# EAGLE design Siscom Seguidor_1 (EAGLE 7.6.0)
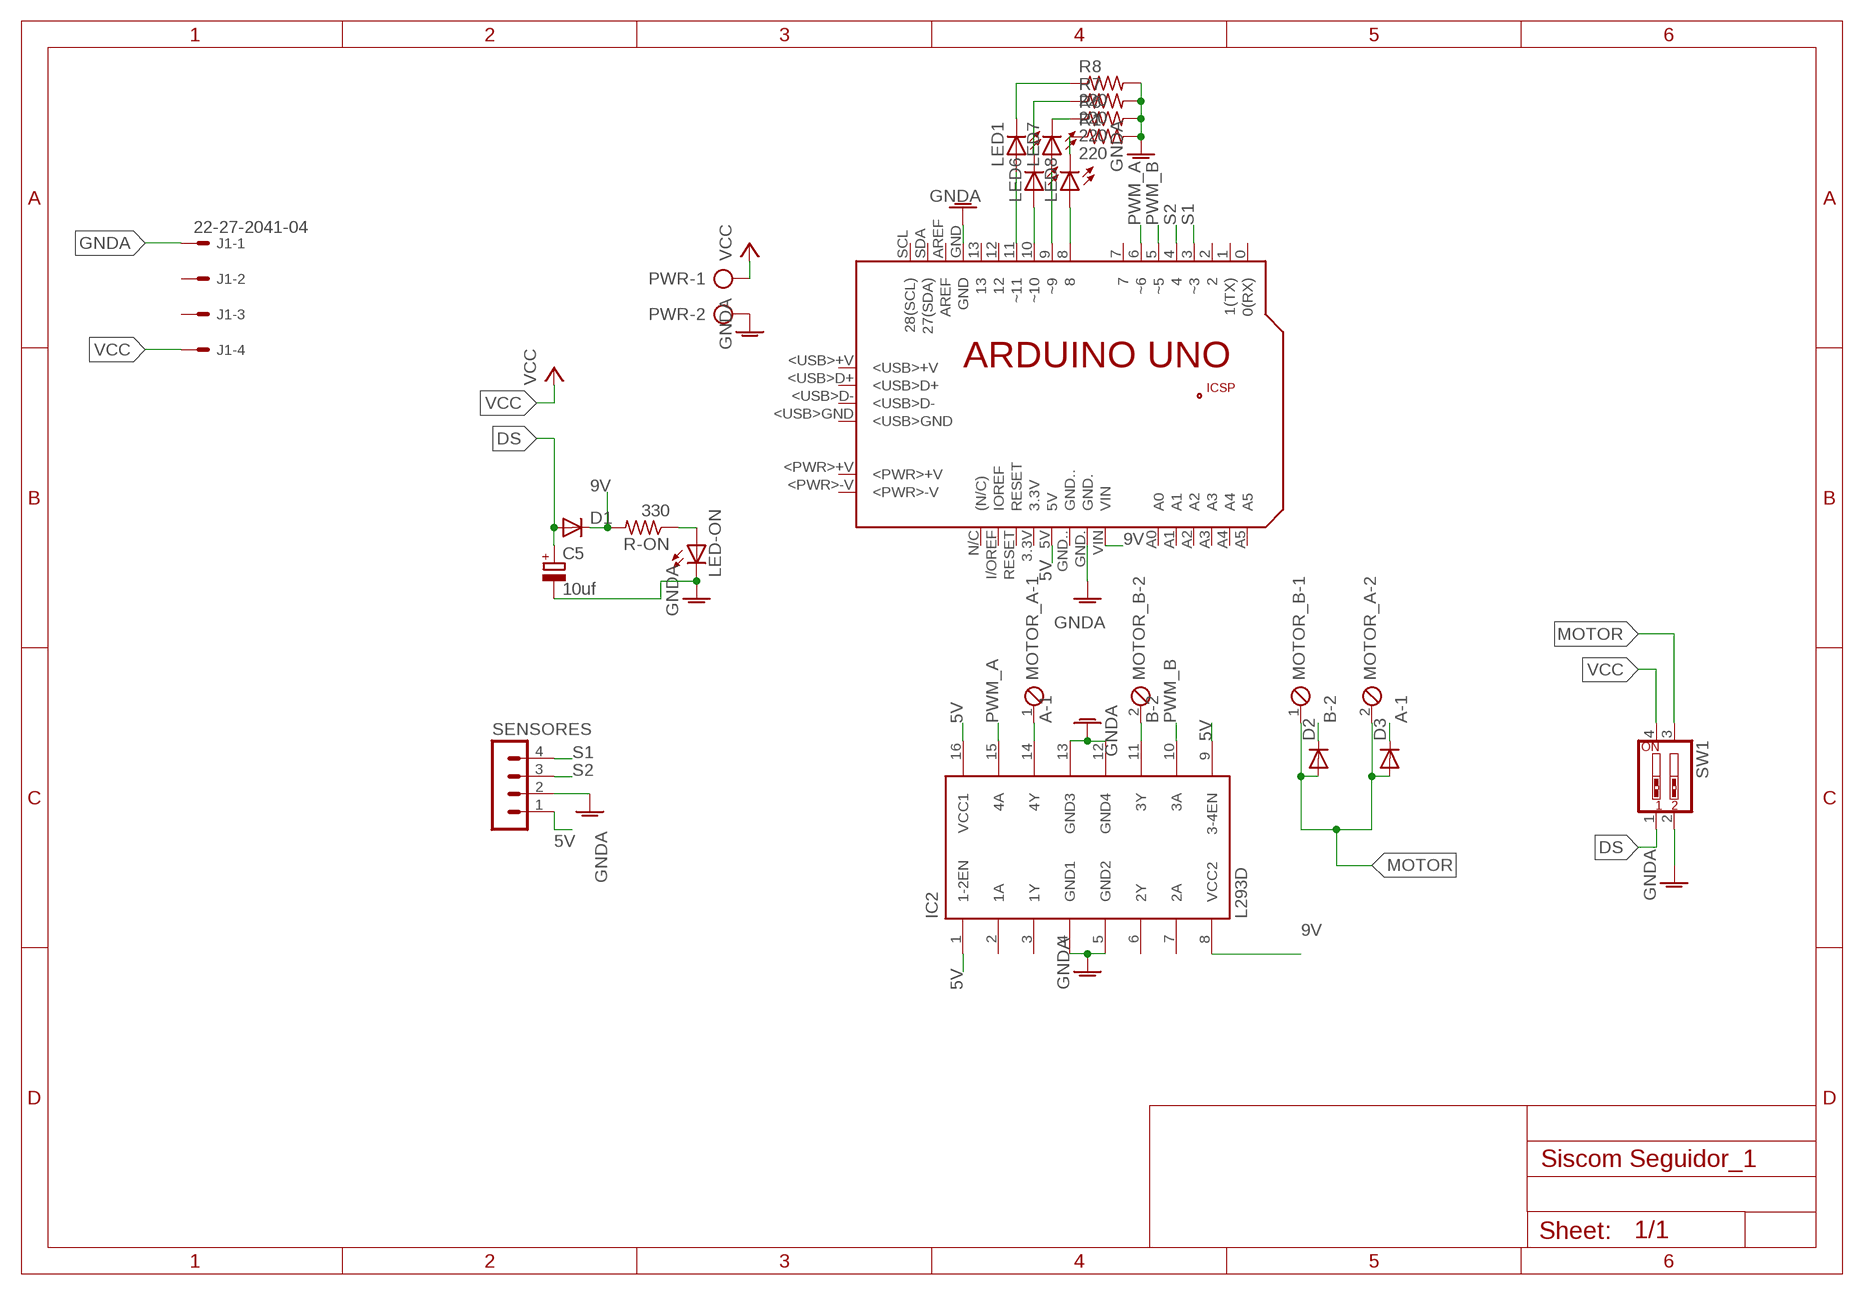
[diagram p0: schematic, sheet 1]

## Parts
C5  10uf  CPOL-EUE2,5-6E  [E2,5-6E]
D1  1N4148DO35-7  [DO35-7]
D2  1N4148DO35-7  [DO35-7]
D3  1N4148DO35-7  [DO35-7]
IC2  L293D  [DIL16]
J1  22-27-2041-04  [6410-04]
LED1  LED3MM  [LED3MM]
LED6  LED3MM  [LED3MM]
LED7  LED3MM  [LED3MM]
LED8  LED3MM  [LED3MM]
LED-ON  LED3MM  [LED3MM]
MOTOR_A  MPT2  [2POL254]
MOTOR_B  MPT2  [2POL254]
PCB2  ARDUINO_UNO  [ARDUINO_UNO]
PWR  AK500/2  [AK500/2]
R1  220  R-US_0204/7  [0204/7]
R6  220  R-US_0204/7  [0204/7]
R7  220  R-US_0204/7  [0204/7]
R8  220  R-US_0204/7  [0204/7]
R-ON  330  R-US_0204/7  [0204/7]
SENSORES  MA04-1  [MA04-1]
SW1  SW_DIP-2  [EDG-02]

## Nets
5V: IC2.1(1-2EN) IC2.9(3-4EN) IC2.16(VCC1) PCB2.5V SENSORES.1
9V: D1.C IC2.8(VCC2) PCB2.VIN R-ON.2
A-1: D3.C IC2.14(4Y) MOTOR_A.1
B-2: D2.C IC2.11(3Y) MOTOR_B.2
DS: C5.+ D1.A SW1.1
GNDA: C5.- IC2.4(GND1) IC2.5(GND2) IC2.12(GND4) IC2.13(GND3) J1.1 LED-ON.K(C) PCB2.GND PCB2.GND. PWR.2 R1.2 R6.2 R7.2 R8.2 SENSORES.2 SW1.2
MOTOR: D2.A D3.A MOTOR_A.2 MOTOR_B.1 SW1.3
N$9: LED-ON.A R-ON.1
N$22: LED8.K(C) R1.1
N$23: LED7.K(C) R6.1
N$24: LED6.K(C) R7.1
N$25: LED1.K(C) R8.1
N$26: LED7.A PCB2.9(~9)
N$27: LED1.A PCB2.11(~11)
N$28: LED6.A PCB2.10(~10)
N$29: LED8.A PCB2.8
PWM_A: IC2.15(4A) PCB2.6(~6)
PWM_B: IC2.10(3A) PCB2.5(~5)
S1: PCB2.3(~3) SENSORES.4
S2: PCB2.4 SENSORES.3
VCC: J1.4 PWR.1 SW1.4
Unconnected: IC2.2(1A) IC2.3(1Y) IC2.6(2Y) IC2.7(2A) J1.2 J1.3 PCB2.0(0(RX)) PCB2.1(1(TX)) PCB2.2 PCB2.3.3V PCB2.7 PCB2.12 PCB2.13 PCB2.+5V PCB2.<PWR>+V PCB2.<PWR>-V PCB2.<USB>+V PCB2.<USB>D+ PCB2.<USB>D- PCB2.<USB>GND PCB2.A0 PCB2.A1 PCB2.A2 PCB2.A3 PCB2.A4 PCB2.A5 PCB2.AREF PCB2.GND.. PCB2.GND_ PCB2.I/OREF(IOREF) PCB2.MISO PCB2.MOSI PCB2.N/C((N/C)) PCB2.RESET PCB2.RESET. PCB2.SCK PCB2.SCL(28(SCL)) PCB2.SDA(27(SDA))

## Library data of the parts
C5 = rcl:CPOL-EU: POLARIZED CAPACITOR, European symbol
D1-D3 = _mod_diode:1N4148: DIODE high speed (Philips)
IC2 = st-microelectronics:L293D: PUSH-PULL 4 CHANNEL DRIVER; MPN: L293D; OC_FARNELL: 9589619; OC_NEWARK: 56P8249
J1 = con-molex:22-?-04: CONNECTOR wire to board 2.54 mm (.1 inch) pitch header; OC_FARNELL: unknown; OC_NEWARK: unknown
LED1 LED6-LED8 LED-ON = led:LED: LED OSRAM: - CHIPLED LG R971, LG N971, LY N971, LG Q971, LY Q971, LO R971, LY R971 LH N974, LH R974 LS Q976, LO Q976, LY Q976 LO Q996 - Hyper CHIPLED LW Q18S LB Q993, LB Q99A, LB R99A - SideLED LS A670, LO A670, LY A670, LG A670, LP A670 LB A673, LV A673, LT A673, LW A673 LH A674 LY A675 LS A676, LA A676, LO A676, LY A676, LW A676 LS A679, LY A679, LG A679 - Hyper Micro SIDELED® LS Y876, LA Y876, LO Y876, LY Y876 LT Y87S - SmartLED LW L88C, LW L88S LB L89C, LB L89S, LG L890 LS L89K, LO L89K, LY L89K LS L896, LA L896, LO L896, LY L896 - TOPLED LS T670, LO T670, LY T670, LG T670, LP T670 LSG T670, LSP T670, LSY T670, LOP T670, LYG T670 LG T671, LOG T671, LSG T671 LB T673, LV T673, LT T673, LW T673 LH T674 LS T676, LA T676, LO T676, LY T676, LB T676, LH T676, LSB T676, LW T676 LB T67C, LV T67C, LT T67C, LS T67K, LO T67K, LY T67K, LW E67C LS E67B, LA E67B, LO E67B, LY E67B, LB E67C, LV E67C, LT E67C LW T67C LS T679, LY T679, LG T679 LS T770, LO T770, LY T770, LG T770, LP T770 LB T773, LV T773, LT T773, LW T773 LH T774 LS E675, LA E675, LY E675, LS T675 LS T776, LA T776, LO T776, LY T776, LB T776 LHGB T686 LT T68C, LB T68C - Hyper Mini TOPLED® LB M676 - Mini TOPLED Santana® LG M470 LS M47K, LO M47K, LY M47K Source: http://www.osram.convergy.de LUXEON: - LUMILED® LXK2-PW12-R00, LXK2-PW12-S00, LXK2-PW14-U00, LXK2-PW14-V00 LXK2-PM12-R00, LXK2-PM12-S00, LXK2-PM14-U00 LXK2-PE12-Q00, LXK2-PE12-R00, LXK2-PE12-S00, LXK2-PE14-T00, LXK2-PE14-U00 LXK2-PB12-K00, LXK2-PB12-L00, LXK2-PB12-M00, LXK2-PB14-N00, LXK2-PB14-P00, LXK2-PB14-Q00 LXK2-PR12-L00, LXK2-PR12-M00, LXK2-PR14-Q00, LXK2-PR14-R00 LXK2-PD12-Q00, LXK2-PD12-R00, LXK2-PD12-S00 LXK2-PH12-R00, LXK2-PH12-S00 LXK2-PL12-P00, LXK2-PL12-Q00, LXK2-PL12-R00 Source: www.luxeon.com KINGBRIGHT: KA-3528ASYC Source: www.kingbright.com
MOTOR_A MOTOR_B = con-phoenix-254:MPT2: PHOENIX CONNECTOR; OC_FARNELL: unknown; OC_NEWARK: unknown
PCB2 = E14_Arduino_revC:ARDUINO_UNO: Device for representing an Arduino Uno board with a footprint in an EAGLE design. Created by Dave Young for Element14. More EAGLE documentation at: http://www.element14.com/community/community/knode/cadsoft_eagle
PWR = con-ptr500:AK500/2: CONNECTOR; OC_FARNELL: unknown; OC_NEWARK: unknown
R1 R6-R8 R-ON = rcl:R-US_: RESISTOR, American symbol
SENSORES = con-lstb:MA04-1: PIN HEADER; OC_FARNELL: unknown; OC_NEWARK: unknown
SW1 = special:SW_DIP-2: DIP SWITCH

## Board
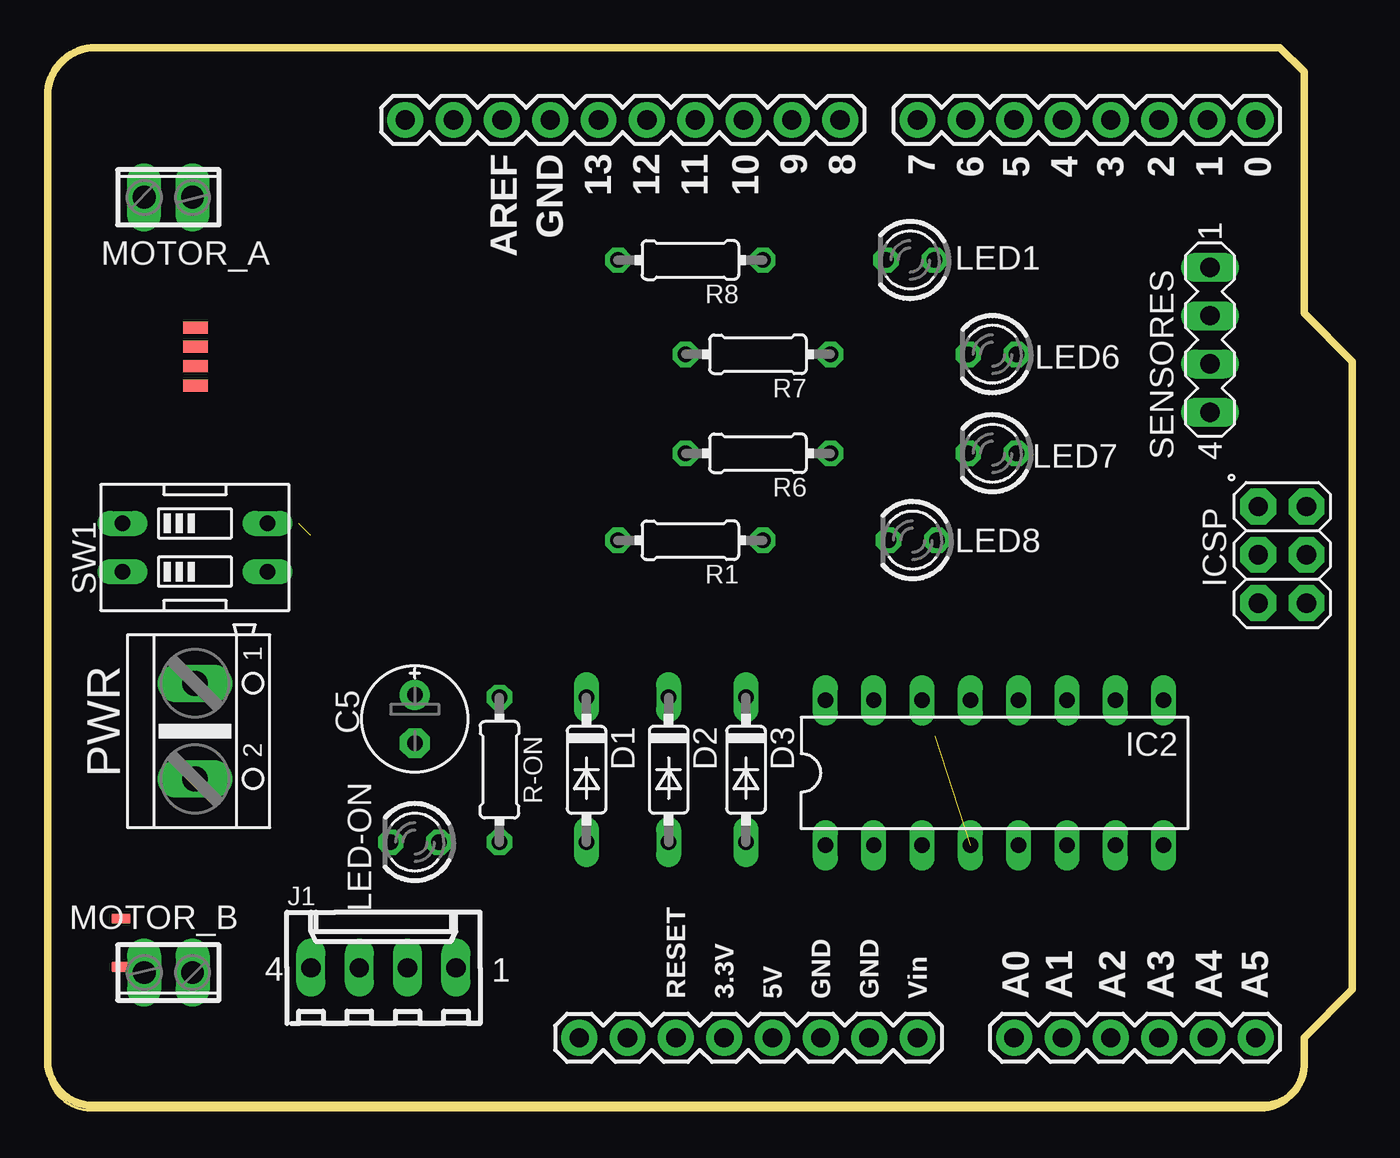
[diagram p1: board, top side]
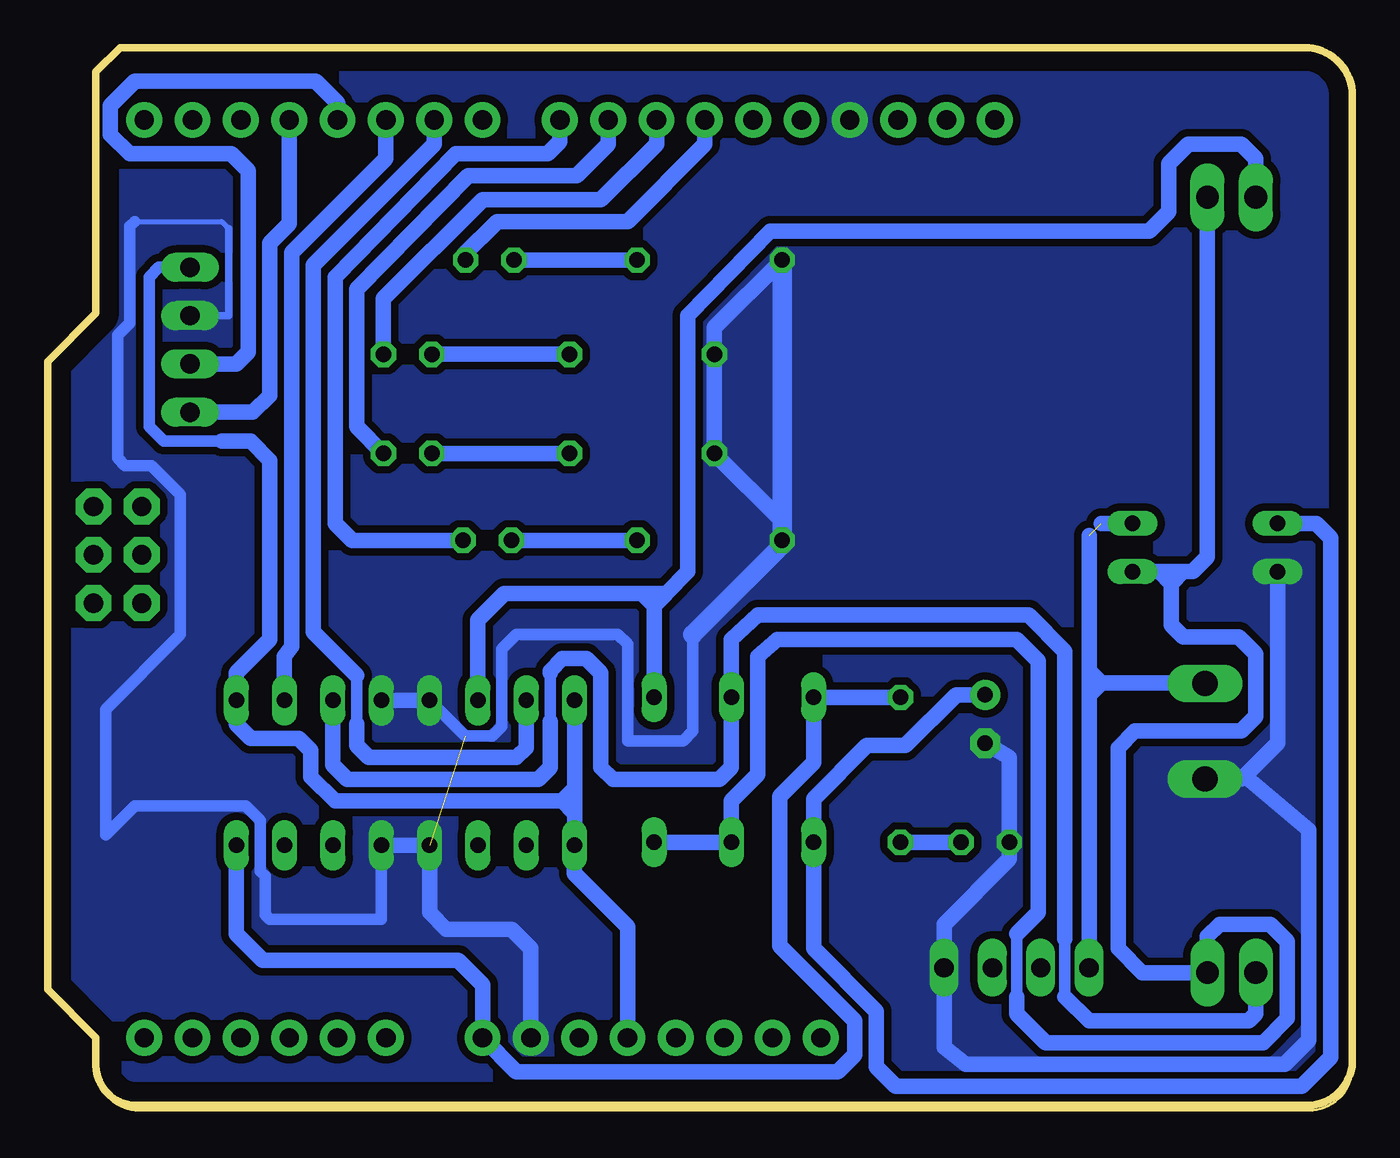
[diagram p2: board, bottom side, seen from below]

Size 68.58 x 55.63 mm. Coordinates in mm from the lower left corner, seen from the top.
Outline: 2.54,0 64.01,0 arc90 66.04,2.29 66.04,3.56 68.58,6.1 68.58,39.12 66.04,41.66 66.04,54.36 64.77,55.63 2.54,55.63 arc90 0,53.09 0,2.29 arc90 2.54,0
Copper layers (1*16): Top 0.035mm / dielectric 1.5mm / Bottom 0.035mm
Design rules "default": minimum track width 10mil, minimum drill 24mil, track to track 8mil, track to pad 8mil, pad to pad 8mil, via to via 8mil, smd to smd 8mil, copper to edge 40mil, drill to drill 8mil, minimum pad ring 10mil, minimum via ring 8mil, stop-mask expansion 4mil, vias tented up to drill 0mil, thermal gap 10mil

### Footprints (pad centres in the part's own frame; a part is rotated, then mirrored left to right if it is on the bottom)
E2,5-6E = drill 0.813 pad 1.575: + -1.27,0 | drill 0.813 pad 1.575 octagon: - 1.27,0
DO35-7 = drill 0.813 long: A 3.81,0; C -3.81,0
DIL16 = drill 0.813 long: 1 -8.89,-3.81; 2 -6.35,-3.81; 3 -3.81,-3.81; 4 -1.27,-3.81; 5 1.27,-3.81; 6 3.81,-3.81; 7 6.35,-3.81; 8 8.89,-3.81; 9 8.89,3.81; 10 6.35,3.81; 11 3.81,3.81; 12 1.27,3.81; 13 -1.27,3.81; 14 -3.81,3.81; 15 -6.35,3.81; 16 -8.89,3.81
6410-04 = drill 1.016 long: 1 3.81,0; 2 1.27,0; 3 -1.27,0; 4 -3.81,0
LED3MM = drill 0.813 octagon: A -1.27,0; K 1.27,0
2POL254 = drill 1.2 long: 1 -1.27,0; 2 1.27,0
ARDUINO_UNO = drill 1.016 pad 1.88: 0 63.5,50.8; 1 60.96,50.8; 2 58.42,50.8; 3 55.88,50.8; 3.3V 35.56,2.54; 4 53.34,50.8; 5 50.8,50.8; 5V 38.1,2.54; 6 48.26,50.8; 7 45.72,50.8; 8 41.656,50.8; 9 39.116,50.8; 10 36.576,50.8; 11 34.036,50.8; 12 31.496,50.8; 13 28.956,50.8; A0 50.8,2.54; A1 53.34,2.54; A2 55.88,2.54; A3 58.42,2.54; A4 60.96,2.54; A5 63.5,2.54; AREF 23.876,50.8; GND 26.416,50.8; GND. 43.18,2.54; GND.. 40.64,2.54; I/OREF 30.48,2.54; N/C 27.94,2.54; RESET 33.02,2.54; SCL 18.796,50.8; SDA 21.336,50.8; VIN 45.72,2.54 | drill 1.016 pad 1.88 octagon: +5V 66.167,30.48; GND_ 66.167,25.4; MISO 63.627,30.48; MOSI 66.167,27.94; RESET. 63.627,25.4; SCK 63.627,27.94 | smd 1.016 x 0.508: <PWR>+V 3.861,8.814; <PWR>-V 3.861,6.274 | smd 1.27 x 0.635: <USB>+V 7.772,39.878; <USB>D+ 7.772,38.887; <USB>D- 7.772,37.871; <USB>GND 7.772,36.83
AK500/2 = drill 1.321 long: 1 -2.515,0; 2 2.515,0
0204/7 = drill 0.813 octagon: 1 -3.81,0; 2 3.81,0
MA04-1 = drill 1.016 long: 1 -3.81,0; 2 -1.27,0; 3 1.27,0; 4 3.81,0
EDG-02 = drill 0.813 long: 1 -1.27,-3.81; 2 1.27,-3.81; 3 1.27,3.81; 4 -1.27,3.81

### Placement (x,y rotation side)
C5  19.3,20.32 270 top
D1  28.32,17.65 270 top
D2  32.64,17.65 270 top
D3  36.7,17.65 270 top
IC2  49.77,17.49 0 top
J1  17.65,7.24 0 top
LED1  45.34,44.45 180 top
LED6  49.66,39.5 180 top
LED7  49.66,34.29 180 top
LED8  45.47,29.72 180 top
LED-ON  19.3,13.84 180 top
MOTOR_A  6.35,47.75 0 top
MOTOR_B  6.35,6.99 180 top
PCB2  0,1.02 0 top
PWR  7.75,19.69 270 top
R1  33.78,29.72 180 top
R6  37.34,34.29 180 top
R7  37.34,39.5 180 top
R8  33.78,44.45 180 top
R-ON  23.75,17.65 90 top
SENSORES  61.09,40.26 270 top
SW1  7.75,29.34 270 top

### Tracks (layer width: path | path; a pad name or v marks a point on that pad's centre or on a via)
5V
  Bottom 0.61: 59.44,34.93 62.48,34.93 63.25,35.69 63.25,43.56 62.74,44.07 SENSORES.1
  Bottom 0.813: IC2.16 40.88,16 | 40.88,16 IC2.1 40.89,13.67 40.89,12.19 38.1,9.4 PCB2.5V | 41.53,16 53.47,16 54.74,17.27 54.74,18.67 55.37,19.31 57.91,19.31 58.66,20.05 IC2.9 58.67,21.31 58.67,22.73 56.9,24.51 56.9,33.91 57.91,34.93 59.44,34.93 | 40.88,16 41.53,16 | 41.53,16 40.89,16.64 | 41.53,16 40.89,15.37
9V
  Bottom 0.813: IC2.8 58.67,13.67 58.67,9.02 57.28,7.62 46.99,7.62 45.72,6.35 PCB2.VIN 43.94,1.78 27.05,1.78 26.16,2.67 26.16,4.45 30.1,8.38 30.1,16.26 28.32,18.04 D1.C R-ON.2
A-1
  Bottom 0.813: IC2.14 45.96,25.54 44.58,26.93 37.34,26.93 | 37.34,26.93 36.83,26.93 | 36.83,26.93 36.07,26.93 | 36.07,26.93 34.92,28.07 34.92,41.53 30.61,45.98 10.67,45.98 9.65,46.99 9.65,49.53 8.64,50.55 5.84,50.55 5.08,49.79 MOTOR_A.1 | D3.C 36.7,26.29 | 36.7,26.29 36.7,26.8 36.83,26.93 | 37.34,26.93 36.7,26.29 | 36.7,26.29 36.07,26.93
B-2
  Bottom 0.61: 15.11,5.72 15.11,8.76 | 42.16,22.73 42.16,20.19
  Bottom 0.813: MOTOR_B.2 5.08,4.83 5.46,4.45 13.84,4.45 15.11,5.72 | 15.11,8.76 15.11,23.88 17.02,25.78 31.24,25.78 32.64,24.51 D2.C 32.64,17.78 33.27,17.15 38.86,17.15 39.5,17.78 39.5,22.73 40.26,23.5 41.53,23.5 42.16,22.86 42.16,22.73 | 42.16,20.19 42.16,17.78 42.8,17.15 52.83,17.15 53.59,17.91 53.59,21.29 IC2.11
DS
  Bottom 0.813: SW1.1 1.91,30.61 1.14,29.85 1.14,2.54 2.67,1.02 24,1.02 25.02,2.03 25.02,4.95 28.32,8.26 D1.A 28.32,16.13 25.53,18.92 23.5,18.92 20.83,21.59 C5.+
GNDA  (1 unrouted)
  Bottom 0.254: 64.01,46.48 59.44,46.48 59.05,46.1
  Bottom 0.406: SENSORES.2 59.05,41.53 59.05,46.1
  Bottom 0.61: IC2.5 51.04,9.79 51.05,9.78 56.9,9.78 57.15,10.03 57.15,12.07 57.4,12.32 57.4,14.99 58.17,15.75 64.01,15.75 65.53,14.23 65.53,20.83 61.59,24.77 61.59,32.13 63.12,33.66 64.52,33.66 64.9,34.04 64.9,40.51 64.26,41.15 64.26,46.23 64.01,46.48 | 34.67,24.77 34.67,19.69 35.18,19.18 38.1,19.18 38.1,24.26 38.61,24.77 43.94,24.77 44.7,24 44.7,19.94 45.21,19.43 46.63,19.43 IC2.13
  Bottom 0.813: IC2.12 IC2.13 | IC2.5 IC2.4 48.5,10.15 47.62,9.27 44.2,9.27 43.18,8.26 PCB2.GND. | R1.2 29.97,30.74 R6.2 R7.2 33.53,40.9 R8.2 | PWR.2 5.82,17.17 5.65,17.34 | 5.65,17.34 3.94,19.05 SW1.2 | J1.1 21.46,8 | C5.- 18.03,18.29 LED-ON.K 18.03,12.96 21.46,9.53 J1.1 | J1.1 21.46,3.05 20.32,2.16 3.56,2.16 2.29,3.43 2.29,14.48 5.65,17.34
  Bottom 1.016: R8.2 29.97,29.47 34.67,24.77
  pour Bottom (isolate 0.39, no thermals): 2.54,55.63 arc90 0,53.09 0,2.29 arc90 2.29,-0.13 64.52,-0.13 arc90 66.04,2.29 66.04,3.56 68.71,6.22 68.71,39.24 66.04,41.66 66.04,54.36 64.77,55.63
MOTOR
  Bottom 0.61: 17.65,9.02 17.65,5.72
  Bottom 0.813: 9.52,27.43 9.52,25.27 8.89,24.64 5.97,24.64 5.08,23.75 5.08,20.45 5.84,19.69 11.43,19.69 12.32,18.8 12.32,8.26 11.05,6.99 MOTOR_B.1 7.62,8.89 6.99,9.53 4.32,9.53 3.43,8.64 3.43,4.57 4.7,3.3 16.13,3.3 17.65,4.83 17.65,5.72 | 9.52,27.43 10.16,28.07 | 10.16,28.07 SW1.3 | 8.89,28.07 8.38,28.07 7.62,28.83 MOTOR_A.2 | 17.65,9.02 16.51,10.16 16.51,23.37 17.65,24.51 30.23,24.51 31.24,23.62 31.24,17.4 32.64,16 D2.A D3.A | 10.16,28.07 8.89,28.07 | 8.89,28.07 9.52,27.43
N$9
  Bottom 0.813: R-ON.1 LED-ON.A
N$22
  Bottom 0.813: R1.1 LED8.K
N$23
  Bottom 0.813: LED7.K R6.1
N$24
  Bottom 0.813: R7.1 LED6.K
N$25
  Bottom 0.813: LED1.K R8.1
N$26
  Bottom 0.813: LED7.A 52.32,35.69 52.32,42.93 46.48,48.9 40.77,48.9 39.12,50.55 PCB2.9
N$27
  Bottom 0.813: LED1.A 46.74,44.71 44.96,46.48 38.1,46.48 34.04,50.55 PCB2.11
N$28
  Bottom 0.813: LED6.A 50.93,42.42 45.72,47.63 39.5,47.63 36.58,50.55 PCB2.10
N$29
  Bottom 0.813: LED8.A 52.58,29.72 53.47,30.61 53.47,43.56 47.12,50.04 42.29,50.04 41.66,50.67 PCB2.8
PWM_A  (1 unrouted)
  Bottom 0.61: 52.32,22.61 52.32,20.07
  Bottom 0.813: PCB2.6 48.26,50.55 54.61,44.2 54.61,24.89 52.32,22.61 | 43.43,21.29 43.43,18.8 43.94,18.29 51.69,18.29 52.32,18.92 52.32,20.07
PWM_B
  Bottom 0.813: PCB2.5 50.8,49.79 55.75,44.83 55.75,24.13 56.13,23.62 56.13,21.31 IC2.10
S1
  Bottom 0.813: PCB2.3 55.88,46.36 56.9,45.34 56.9,37.34 57.78,36.45 SENSORES.4
S2
  Bottom 0.813: PCB2.4 53.34,52.71 54.48,53.85 64.01,53.85 65.28,52.58 65.28,51.06 64.26,50.04 58.93,50.04 58.04,49.15 58.04,39.63 58.67,38.99 SENSORES.3
VCC  (1 unrouted)
  Bottom 0.813: PWR.1 7.77,22.23 13.21,22.23 | J1.4 13.84,21.59 | 13.84,21.59 13.84,22.35 | 13.84,22.35 13.84,22.86 | 13.84,22.86 13.84,29.97 | 13.21,30.61 SW1.4 | 13.21,22.23 13.72,22.23 13.84,22.35 | 13.84,22.86 13.21,22.23 | 13.21,22.23 13.84,21.59

### Text on the board
tValues: VCC | GND | S1 | S2 | Seguiduino UNO | J.T.E.V. 03/2017